# EAGLE board CrowPanel Pico Display-2.4_V1.0_240412 (EAGLE 9.6.2)
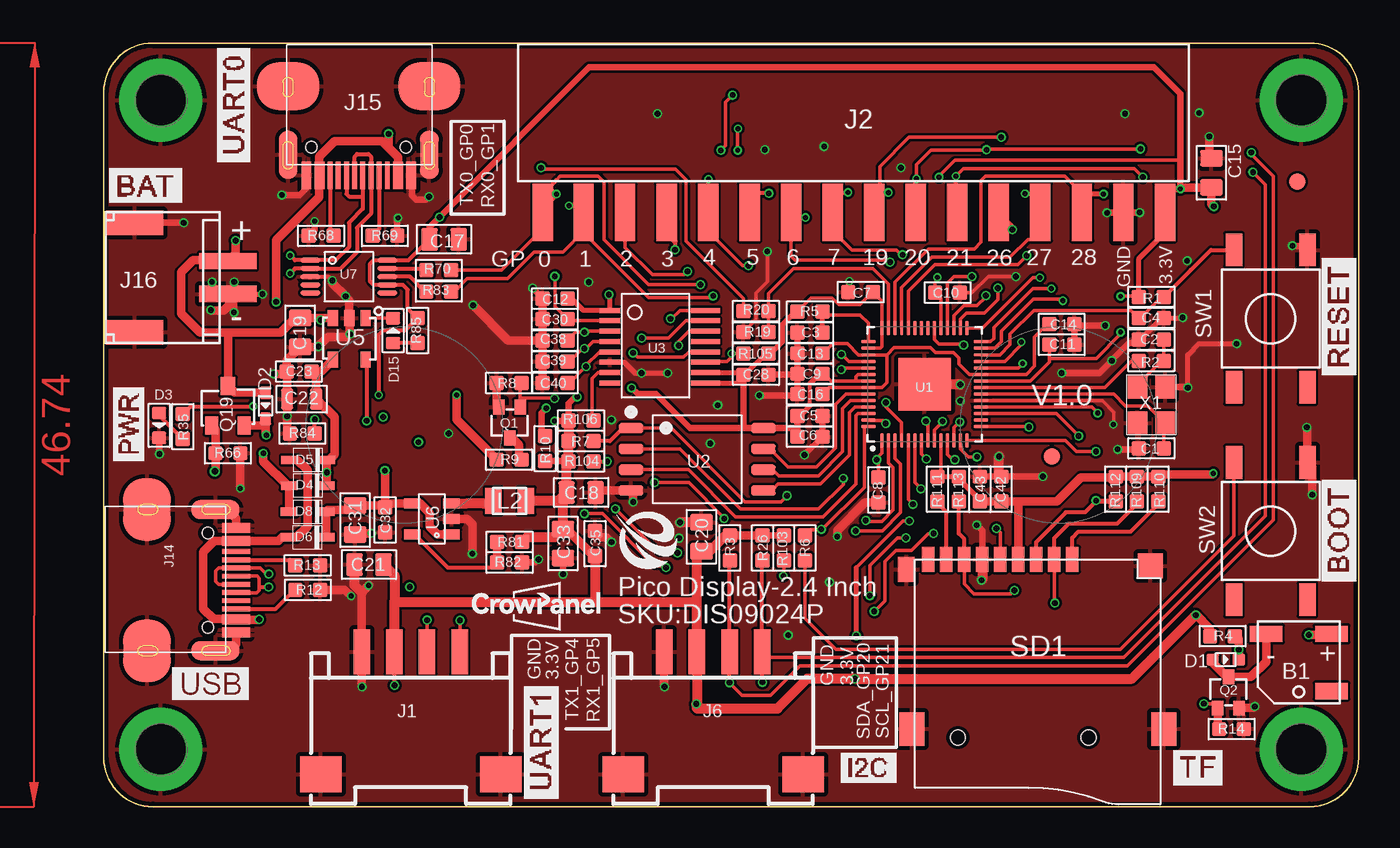
[diagram p5: board, top side]
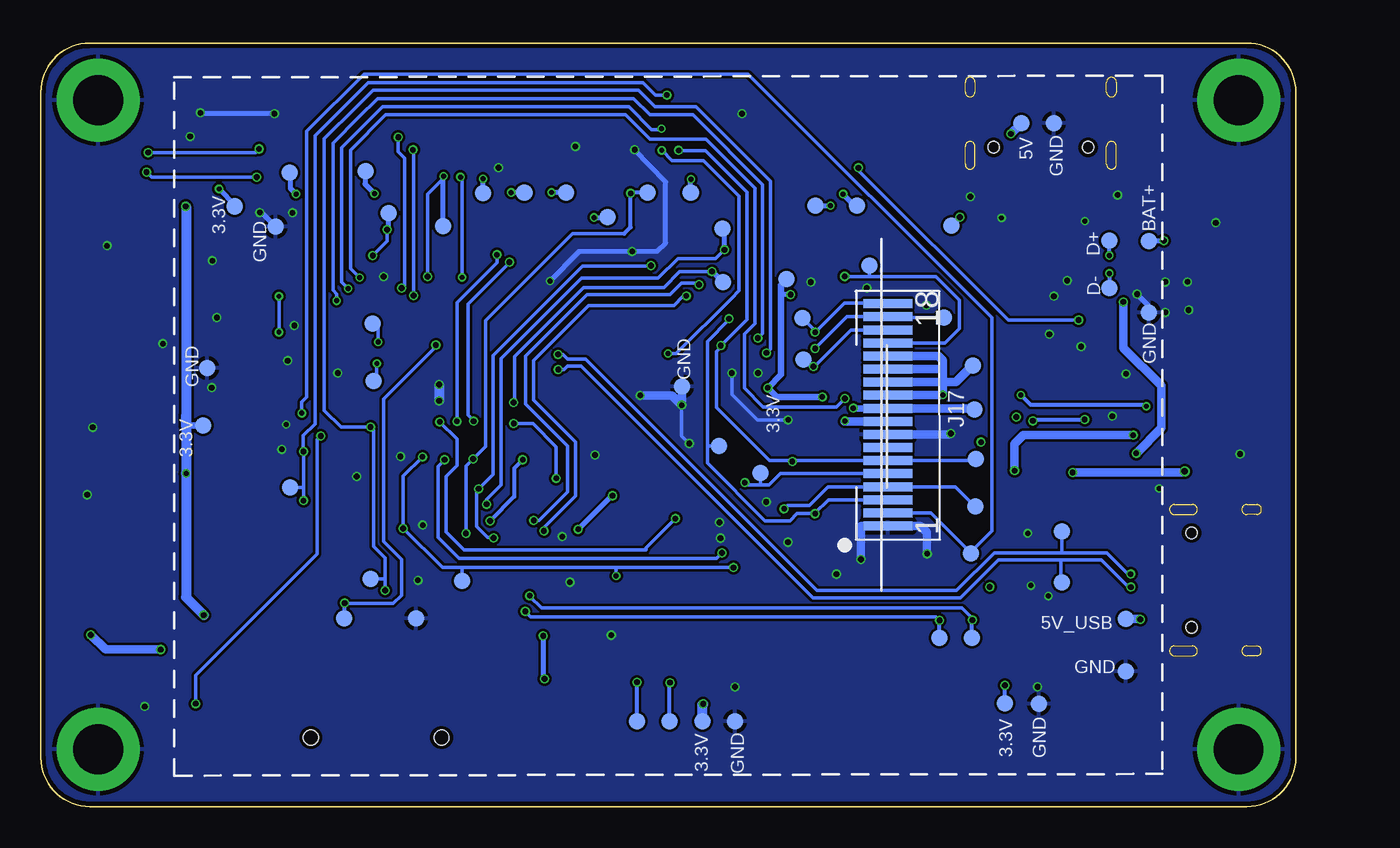
[diagram p6: board, bottom side, seen from below]

Size 76.76 x 46.72 mm. Coordinates in mm from the lower left corner, seen from the top.
Outline: 0,3 0,43.72 arc-90 3,46.72 73.76,46.72 arc-90 76.76,43.72 76.76,3 arc-90 73.76,0 3,0 arc-90 0,3
Copper layers (1*16): Top 0.035mm / dielectric 1.5mm / Bottom 0.035mm
Design rules "default *": minimum track width 0.2mm, minimum drill 0.3mm, track to track 6mil, track to pad 6mil, pad to pad 6mil, via to via 6mil, smd to smd 6mil, copper to edge 10mil, drill to drill 6mil, minimum pad ring 10mil, minimum via ring 4mil, stop-mask expansion 4mil, vias tented up to drill 100mil, thermal gap 10mil
Net classes: 1 PWR: width 0.254 mm; 2 GND: width 0.203 mm; 3 RS485: width 0.203 mm, clearance 0.203 mm; 4 USB: width 0.203 mm, clearance 0.152 mm; 5 ANT: width 0.889 mm, clearance 0.203 mm

## Footprints (pad centres in the part's own frame; a part is rotated, then mirrored left to right if it is on the bottom)
BEEP_5025 = smd 2 x 1: 1 -2,-1.75; 2 2,-1.75; 3 -2,1.75
A_XBJ_0603 = smd 0.889 x 0.889: 1 -0.762,0; 2 0.762,0
A_XBJ_0805 = smd 1.016 x 1.397: 1 -0.889,0; 2 0.889,0
0805_S = smd 0.762 x 1.27: 1 -0.889,0; 2 0.889,0
C0603 = smd 0.889 x 0.889: 1 -0.762,0; 2 0.762,0
DISCRETE_C0603 = smd 0.889 x 0.889: 1 -0.762,0; 2 0.762,0
0603 = smd 0.889 x 0.889: 1 -0.762,0; 2 0.762,0
SOD-523 = smd 0.762 x 0.7: + -0.8,0; - 0.8,0
DISCRETE_D0603 = smd 0.762 x 0.889: + -0.762,0; - 0.762,0
SOD-323 = smd 1.016 x 0.508: 1 1.137,0; 2 -1.137,0
CONNECTOR_4P-SMD-2.0-90D = smd 1.01 x 2.74: 1 -3,-0.1; 2 -1,-0.1; 3 1,-0.1; 4 3,-0.1 | smd 2.54 x 2.184: SS1 -5.5,7.4; SS2 5.5,7.4
2.54-16P-WOTIE = smd 1.25 x 3.5: 1 -18.999,-5.572; 2 -16.51,-5.572; 3 -13.97,-5.572; 4 -11.43,-5.572; 5 -8.89,-5.572; 6 -6.35,-5.572; 7 -3.81,-5.572; 8 -1.27,-5.572; 9 1.27,-5.572; 10 3.81,-5.572; 11 6.35,-5.572; 12 8.89,-5.572; 13 11.43,-5.572; 14 13.97,-5.572; 15 16.51,-5.572; 16 19.05,-5.572
KEVIN_3.0TYPEC-SMD = smd 0.3 x 1.7: A1 -3.35,0.5; A4 -2.55,0.5; A5 -1.25,0.5; A6 -0.25,0.5; A7 0.25,0.5; A8 1.25,0.5; A9 2.55,0.5; A12 3.35,0.5; B1 3.05,0.5; B4 2.25,0.5; B5 1.75,0.5; B6 0.75,0.5; B7 -0.75,0.5; B8 -1.75,0.5; B9 -2.25,0.5; B12 -3.05,0.5 | smd 1.143 x 2.921: P$6 -4.318,-0.762; P$7 4.318,-0.762 | smd 3.81 x 2.921: P$8 -4.318,-4.953; P$9 4.318,-4.953 | hole 0.68: -2.89,-1.22; 2.89,-1.22
PH2.0WT-2PIN = smd 1 x 3.5: P$1 -1,0; P$2 1,0 | smd 1.5 x 3.5: P$3 -3.35,-5.7; P$4 3.35,-5.7
QD241801-18PIN*0.8 = smd 0.55 x 3: P$1 -6.789,-1.538; P$2 -5.989,-1.538; P$3 -5.189,-1.538; P$4 -4.389,-1.538; P$5 -3.589,-1.538; P$6 -2.789,-1.538; P$7 -1.989,-1.538; P$8 -1.189,-1.538; P$9 -0.389,-1.538; P$10 0.411,-1.538; P$11 1.211,-1.538; P$12 2.011,-1.538; P$13 2.811,-1.538; P$14 3.611,-1.538; P$15 4.411,-1.538; P$16 5.211,-1.538; P$17 6.011,-1.538; P$18 6.811,-1.538
0806 = smd 1 x 1.6: 1 -1,0; 2 1,0
CROWPI_POW_PAD-1.0MM = smd 1 x 1: P$1 0,0
PAD-1.0MM = smd 1 x 1: P$1 0,0
SOT-323_W = smd 0.7 x 0.9: 1 -0.65,-0.95; 2 0.65,-0.95; 3 0,0.95
SOT-23 = smd 1.1 x 0.8: 1 1.2,-1; 2 1.2,1 | smd 1.1 x 0.9: 3 -1.2,0
DISCRETE_R0603 = smd 0.889 x 0.889: 1 -0.762,0; 2 0.762,0
9P-SMD-W/-RING = smd 1.524 x 0.762: 1 0,4.4; 2 0,3.3; 3 0,2.2; 4 0,1.1; 5 0,0; 6 0,-1.1; 7 0,-2.2; 8 0,-3.3; 9 0,-4.4 | smd 1.524 x 1.016: G1 0.6,-5.746 | smd 2.032 x 1.524: G2 10.373,-5.4; G3 10.373,10 | smd 1.524 x 1.524: G4 0.392,9.181 | hole 0.889: 10.9,-2.6; 10.9,5.4
KEY-6 = smd 2 x 1: 1 -4.2,2.25; 2 -4.2,-2.25; 3 4.2,-2.25; 4 4.2,2.25
3M-5 = drill 3.048 pad 5.08: 1 0,0
RP2040_QFN-56 = smd 0.875 x 0.2: 1 -3.437,2.6; 2 -3.437,2.2; 3 -3.437,1.8; 4 -3.437,1.4; 5 -3.437,1; 6 -3.437,0.6; 7 -3.437,0.2; 8 -3.437,-0.2; 9 -3.437,-0.6; 10 -3.437,-1; 11 -3.437,-1.4; 12 -3.437,-1.8; 13 -3.437,-2.2; 14 -3.437,-2.6; 29 3.437,-2.6; 30 3.437,-2.2; 31 3.437,-1.8; 32 3.437,-1.4; 33 3.437,-1; 34 3.437,-0.6; 35 3.437,-0.2; 36 3.437,0.2; 37 3.437,0.6; 38 3.437,1; 39 3.437,1.4; 40 3.437,1.8; 41 3.437,2.2; 42 3.437,2.6 | smd 0.2 x 0.875: 15 -2.6,-3.437; 16 -2.2,-3.437; 17 -1.8,-3.437; 18 -1.4,-3.437; 19 -1,-3.437; 20 -0.6,-3.437; 21 -0.2,-3.437; 22 0.2,-3.437; 23 0.6,-3.437; 24 1,-3.437; 25 1.4,-3.437; 26 1.8,-3.437; 27 2.2,-3.437; 28 2.6,-3.437; 43 2.6,3.437; 44 2.2,3.437; 45 1.8,3.437; 46 1.4,3.437; 47 1,3.437; 48 0.6,3.437; 49 0.2,3.437; 50 -0.2,3.437; 51 -0.6,3.437; 52 -1,3.437; 53 -1.4,3.437; 54 -1.8,3.437; 55 -2.2,3.437; 56 -2.6,3.437 | smd 3.2 x 3.2: EPAD 0,0
SELF_SOIC-8-208MIL = smd 1.5 x 0.635: 1 -4.05,1.905; 2 -4.05,0.635; 3 -4.05,-0.635; 4 -4.05,-1.905; 5 4.05,-1.905; 6 4.05,-0.635; 7 4.05,0.635; 8 4.05,1.905
XP2046-SSOP16 = smd 0.305 x 1.27: 1 -2.54,-2.54; 2 -1.905,-2.54; 3 -1.27,-2.54; 4 -0.635,-2.54; 5 0,-2.54; 6 0.635,-2.54; 7 1.27,-2.54; 8 1.905,-2.54 | smd 0.305 x 1.778: 9 1.905,3.302; 10 1.27,3.302; 11 0.635,3.302; 12 0,3.302; 13 -0.635,3.302; 14 -1.27,3.302; 15 -1.905,3.302; 16 -2.54,3.302
SOP23-5 = smd 1 x 0.635: 1 -1.27,1; 2 -1.27,0; 3 -1.27,-1; 4 1.27,-1; 5 1.27,1
CROWBOT_-V1.0-20220525_A_XBJ_SOT23-5 = smd 0.6 x 1: 1 -0.95,-1.2; 2 0,-1.2; 3 0.95,-1.2; 4 0.95,1.2; 5 -0.95,1.2
MSOP-10_W = smd 1.2 x 0.3: 1 -2.35,1; 2 -2.35,0.5; 3 -2.35,0; 4 -2.35,-0.5; 5 -2.35,-1; 6 2.35,-1; 7 2.35,-0.5; 8 2.35,0; 9 2.35,0.5; 10 2.35,1
A_XBJ_SMD3225 = smd 1.4 x 1.2: 1 -1.1,-0.85; 2 1.1,-0.85; 3 1.1,0.85; 4 -1.1,0.85

## Placement (x,y rotation side)
B1  BEEP_5025  [BEEP_5025]  73.1,8.82 180 top
C1  12PF  [A_XBJ_0603]  64.08,21.92 180 top
C2  12PF  [A_XBJ_0603]  64.08,28.59 0 top
C3  2.2UF  [A_XBJ_0603]  43.2,29 180 top
C4  100NF  [A_XBJ_0603]  64.08,29.9 0 top
C5  100NF  [A_XBJ_0603]  43.2,23.9 0 top
C6  2.2UF  [A_XBJ_0603]  43.2,22.63 0 top
C7  100NF  [A_XBJ_0603]  46.3,31.48 180 top
C8  100NF  [A_XBJ_0603]  47.4,19.37 270 top
C9  100NF  [A_XBJ_0603]  43.2,26.48 180 top
C10  100NF  [A_XBJ_0603]  51.62,31.44 0 top
C11  100NF  [A_XBJ_0603]  58.6,28.26 0 top
C12  100NF  [A_XBJ_0603]  27.6,31.08 180 top
C13  100NF  [A_XBJ_0603]  43.2,27.73 180 top
C14  100NF  [A_XBJ_0603]  58.6,29.52 0 top
C15  47UF  [A_XBJ_0805]  67.76,38.78 270 top
C16  2.2UF  [A_XBJ_0603]  43.2,25.23 180 top
C17  47UF  [A_XBJ_0805]  20.82,34.71 0 top
C18  22UF  [A_XBJ_0805]  29.2,19.22 180 top
C19  22UF  [A_XBJ_0805]  12.02,29.01 90 top
C20  47UF  [A_XBJ_0805]  36.56,16.51 90 top
C21  47UF  [A_XBJ_0805]  16.23,14.81 180 top
C22  22uF  [0805_S]  12.12,24.94 0 top
C23  100nF  [C0603]  11.95,26.62 180 top
C28  1uF  [DISCRETE_C0603]  39.9,26.42 180 top
C30  100pF  [0603]  27.6,29.82 0 top
C31  22UF  [A_XBJ_0805]  15.38,17.53 90 top
C32  1UF  [A_XBJ_0603]  17.21,17.54 270 top
C33  22UF  [A_XBJ_0805]  28.09,16.09 90 top
C35  100NF  [A_XBJ_0603]  30.06,16.09 90 top
C38  100pF  [0603]  27.6,28.52 0 top
C39  100pF  [0603]  27.6,27.22 0 top
C40  100pF  [0603]  27.6,25.92 0 top
C42  1uF  [DISCRETE_C0603]  54.9,19.42 270 top
C43  100nF  [C0603]  53.6,19.42 90 top
D1  B5819WT  [SOD-523]  68.63,9 0 top
D2  B5819WT  [SOD-523]  9.9,24.52 270 top
D3  [DISCRETE_D0603]  3.39,23.32 270 top
D4  SOD-323  [SOD-323]  12.49,19.64 180 top
D5  SOD-323  [SOD-323]  12.5,21.21 180 top
D6  SOD-323  [SOD-323]  12.47,16.48 180 top
D8  SOD-323  [SOD-323]  12.47,18.04 180 top
D15  [DISCRETE_D0603]  17.7,29.12 90 top
J1  [CONNECTOR_4P-SMD-2.0-90D]  18.78,9.37 180 top
J2  2.54-16PIN-WOTIE  [2.54-16P-WOTIE]  45.86,41.92 0 top
J6  [CONNECTOR_4P-SMD-2.0-90D]  37.28,9.37 180 top
J14  USB_TYPE-C_16PIN3.0USB  [KEVIN_3.0TYPEC-SMD]  7.6,13.85 270 top
J15  USB_TYPE-C_16PIN3.0USB  [KEVIN_3.0TYPEC-SMD]  15.6,39.12 180 top
J16  PH2.0WT-2PIN  [PH2.0WT-2PIN]  7.6,32.37 270 top
J17  QD281801  [QD241801-18PIN*0.8]  26.5,23.96 90 bottom
L2  2.2UH1.7A  [0806]  24.83,18.7 0 top
P1  CROWPI_POW_PADPAD-1.0MM  [CROWPI_POW_PAD-1.0MM]  10.41,8.27 0 bottom
P2  CROWPI_POW_PADPAD-1.0MM  [CROWPI_POW_PAD-1.0MM]  10.41,11.47 0 bottom
P3  CROWPI_POW_PADPAD-1.0MM  [CROWPI_POW_PAD-1.0MM]  14.3,13.71 0 bottom
P4  CROWPI_POW_PADPAD-1.0MM  [CROWPI_POW_PAD-1.0MM]  14.3,16.82 0 bottom
P5  CROWPI_POW_PADPAD-1.0MM  [CROWPI_POW_PAD-1.0MM]  19.66,24.29 0 bottom
P6  CROWPI_POW_PADPAD-1.0MM  [CROWPI_POW_PAD-1.0MM]  8.98,30.23 0 bottom
P7  CROWPI_POW_PADPAD-1.0MM  [CROWPI_POW_PAD-1.0MM]  9,34.61 0 bottom
P8  CROWPI_POW_PADPAD-1.0MM  [CROWPI_POW_PAD-1.0MM]  26.85,36.78 0 bottom
P9  CROWPI_POW_PADPAD-1.0MM  [CROWPI_POW_PAD-1.0MM]  53.8,11.52 0 bottom
P10  CROWPI_POW_PADPAD-1.0MM  [CROWPI_POW_PAD-1.0MM]  17.8,6.32 0 bottom
P11  CROWPI_POW_PADPAD-1.0MM  [CROWPI_POW_PAD-1.0MM]  56.4,26.05 0 bottom
P12  CROWPI_POW_PADPAD-1.0MM  [CROWPI_POW_PAD-1.0MM]  56.46,29.56 0 bottom
P13  CROWPI_POW_PADPAD-1.0MM  [CROWPI_POW_PAD-1.0MM]  66.83,23.3 0 bottom
P14  CROWPI_POW_PADPAD-1.0MM  [CROWPI_POW_PAD-1.0MM]  15.71,6.3 0 bottom
P15  CROWPI_POW_PADPAD-1.0MM  [CROWPI_POW_PAD-1.0MM]  38.3,5.22 0 bottom
P16  CROWPI_POW_PADPAD-1.0MM  [CROWPI_POW_PAD-1.0MM]  40.3,5.22 0 bottom
P17  CROWPI_POW_PADPAD-1.0MM  [CROWPI_POW_PAD-1.0MM]  29.39,36.78 0 bottom
P18  CROWPI_POW_PADPAD-1.0MM  [CROWPI_POW_PAD-1.0MM]  35.03,32.08 0 bottom
P19  CROWPI_POW_PADPAD-1.0MM  [CROWPI_POW_PAD-1.0MM]  35.07,35.37 0 bottom
P20  CROWPI_POW_PADPAD-1.0MM  [CROWPI_POW_PAD-1.0MM]  37.01,37.57 0 bottom
P21  CROWPI_POW_PADPAD-1.0MM  [CROWPI_POW_PAD-1.0MM]  34.3,5.22 0 bottom
P22  CROWPI_POW_PADPAD-1.0MM  [CROWPI_POW_PAD-1.0MM]  36.3,5.22 0 bottom
P23  CROWPI_POW_PADPAD-1.0MM  [CROWPI_POW_PAD-1.0MM]  19.8,10.32 0 bottom
P24  CROWPI_POW_PADPAD-1.0MM  [CROWPI_POW_PAD-1.0MM]  21.8,10.32 0 bottom
P25  CROWPI_POW_PADPAD-1.0MM  [CROWPI_POW_PAD-1.0MM]  14.8,41.82 0 bottom
P26  CROWPI_POW_PADPAD-1.0MM  [CROWPI_POW_PAD-1.0MM]  16.8,41.82 0 bottom
P27  CROWPI_POW_PADPAD-1.0MM  [CROWPI_POW_PAD-1.0MM]  11.4,34.62 0 bottom
P28  CROWPI_POW_PADPAD-1.0MM  [CROWPI_POW_PAD-1.0MM]  11.4,31.72 0 bottom
P29  CROWPI_POW_PADPAD-1.0MM  [CROWPI_POW_PAD-1.0MM]  37.54,25.7 0 bottom
P30  CROWPI_POW_PADPAD-1.0MM  [CROWPI_POW_PAD-1.0MM]  64.9,36.72 0 bottom
P31  CROWPI_POW_PADPAD-1.0MM  [CROWPI_POW_PAD-1.0MM]  19.88,15.49 0 bottom
P32  CROWPI_POW_PADPAD-1.0MM  [CROWPI_POW_PAD-1.0MM]  35.29,22.07 0 bottom
P33  CROWPI_POW_PADPAD-1.0MM  [CROWPI_POW_PAD-1.0MM]  26.09,33.1 0 bottom
P34  CROWPI_POW_PADPAD-1.0MM  [CROWPI_POW_PAD-1.0MM]  19.59,18.37 0 bottom
P35  CROWPI_POW_PADPAD-1.0MM  [CROWPI_POW_PAD-1.0MM]  32.74,20.42 0 bottom
P36  CROWPI_POW_PADPAD-1.0MM  [CROWPI_POW_PAD-1.0MM]  61.5,19.52 0 bottom
P37  CROWPI_POW_PADPAD-1.0MM  [CROWPI_POW_PAD-1.0MM]  30.12,27.36 0 bottom
P38  CROWPI_POW_PADPAD-1.0MM  [CROWPI_POW_PAD-1.0MM]  21.52,29.94 0 bottom
P39  CROWPI_POW_PADPAD-1.0MM  [CROWPI_POW_PAD-1.0MM]  30.17,29.88 0 bottom
P40  CROWPI_POW_PADPAD-1.0MM  [CROWPI_POW_PAD-1.0MM]  31.15,32.26 0 bottom
P41  CROWPI_POW_PADPAD-1.0MM  [CROWPI_POW_PAD-1.0MM]  19.75,26.99 0 bottom
P42  CROWPI_POW_PADPAD-1.0MM  [CROWPI_POW_PAD-1.0MM]  66.6,26.82 0 bottom
P43  CROWPI_POW_PADPAD-1.0MM  [CROWPI_POW_PAD-1.0MM]  21.07,35.53 0 bottom
P44  CROWPI_POW_PADPAD-1.0MM  [CROWPI_POW_PAD-1.0MM]  19.56,21.28 0 bottom
P45  CROWPI_POW_PADPAD-1.0MM  [CROWPI_POW_PAD-1.0MM]  51,13.82 0 bottom
P46  CROWPI_POW_PADPAD-1.0MM  [CROWPI_POW_PAD-1.0MM]  56.6,13.92 0 bottom
P47  CROWPI_POW_PADPAD-1.0MM  [CROWPI_POW_PAD-1.0MM]  58.2,11.52 0 bottom
P48  PADPAD-1.0MM  [PAD-1.0MM]  73,38.22 0 top
P49  PADPAD-1.0MM  [PAD-1.0MM]  58,21.42 0 top
P50  CROWPI_POW_PADPAD-1.0MM  [CROWPI_POW_PAD-1.0MM]  39.65,37.57 0 bottom
P51  CROWPI_POW_PADPAD-1.0MM  [CROWPI_POW_PAD-1.0MM]  42.11,36.06 0 bottom
P52  CROWPI_POW_PADPAD-1.0MM  [CROWPI_POW_PAD-1.0MM]  44.65,37.56 0 bottom
P53  CROWPI_POW_PADPAD-1.0MM  [CROWPI_POW_PAD-1.0MM]  47.19,37.56 0 bottom
P54  CROWPI_POW_PADPAD-1.0MM  [CROWPI_POW_PAD-1.0MM]  49.71,37.52 0 bottom
P55  CROWPI_POW_PADPAD-1.0MM  [CROWPI_POW_PAD-1.0MM]  52.15,35.52 0 bottom
P56  CROWPI_POW_PADPAD-1.0MM  [CROWPI_POW_PAD-1.0MM]  55.49,36.32 0 bottom
P57  CROWPI_POW_PADPAD-1.0MM  [CROWPI_POW_PAD-1.0MM]  56.91,38.88 0 bottom
P58  CROWPI_POW_PADPAD-1.0MM  [CROWPI_POW_PAD-1.0MM]  61.55,38.78 0 bottom
P59  CROWPI_POW_PADPAD-1.0MM  [CROWPI_POW_PAD-1.0MM]  62.39,35.48 0 bottom
Q1  HXY2102EI  [SOT-323_W]  24.83,23.5 180 top
Q2  HXY2102EI  [SOT-323_W]  68.79,6.99 0 top
Q19  PMOS-3401-4A  [SOT-23]  7.6,24.52 270 top
R1  10K  [DISCRETE_R0603]  64.08,31.18 180 top
R2  1K  [DISCRETE_R0603]  64.08,27.26 180 top
R3  4.7K  [DISCRETE_R0603]  38.3,15.82 90 top
R4  3R  [DISCRETE_R0603]  68.43,10.43 180 top
R5  0R  [DISCRETE_R0603]  43.2,30.28 180 top
R6  1K  [DISCRETE_R0603]  42.9,15.82 270 top
R7  10K  [DISCRETE_R0603]  29.2,22.37 180 top
R8  10K/NC  [DISCRETE_R0603]  24.8,25.92 0 top
R9  0R 1%  [DISCRETE_R0603]  24.8,21.22 180 top
R10  3R  [DISCRETE_R0603]  27,21.91 270 top
R12  5.1K  [DISCRETE_R0603]  12.49,13.26 0 top
R13  5.1K  [DISCRETE_R0603]  12.47,14.76 180 top
R14  10K/NC  [DISCRETE_R0603]  68.99,4.75 180 top
R19  100K1%  [DISCRETE_R0603]  39.9,29.02 180 top
R20  100K1%  [DISCRETE_R0603]  39.9,30.32 0 top
R26  4.7K  [DISCRETE_R0603]  40.3,15.82 90 top
R35  4.7K  [DISCRETE_R0603]  4.84,23.25 90 top
R66  10K  [DISCRETE_R0603]  7.6,21.62 180 top
R68  5.1K  [DISCRETE_R0603]  13.3,34.92 180 top
R69  5.1K  [DISCRETE_R0603]  17.2,34.92 180 top
R70  0R  [DISCRETE_R0603]  20.5,32.82 0 top
R81  45.3K 1%  [DISCRETE_R0603]  24.83,16.19 180 top
R82  10K 1%  [DISCRETE_R0603]  24.83,14.93 180 top
R83  0R  [DISCRETE_R0603]  20.5,31.52 0 top
R84  2K  [DISCRETE_R0603]  12.15,22.84 180 top
R85  4.7K  [DISCRETE_R0603]  19.2,29.12 90 top
R103  1K  [DISCRETE_R0603]  41.6,15.82 90 top
R104  1K  [DISCRETE_R0603]  29.2,21.12 180 top
R105  10K  [DISCRETE_R0603]  39.9,27.72 0 top
R106  10K/NC  [DISCRETE_R0603]  29.2,23.62 0 top
R109  10K  [DISCRETE_R0603]  63.2,19.42 270 top
R110  10K  [DISCRETE_R0603]  64.5,19.42 270 top
R111  10K  [DISCRETE_R0603]  51,19.42 270 top
R112  10K  [DISCRETE_R0603]  61.9,19.42 270 top
R113  10K  [DISCRETE_R0603]  52.3,19.42 270 top
SD1  [9P-SMD-W/-RING]  54.84,15.12 270 top
SW1  KEY-6  [KEY-6]  71.38,29.86 270 top
SW2  KEY-6  [KEY-6]  71.38,16.86 270 top
T1  3M-5  [3M-5]  3.5,43.22 0 top
T2  3M-5  [3M-5]  3.5,3.5 0 top
T3  3M-5  [3M-5]  73.26,3.5 0 top
T4  3M-5  [3M-5]  73.26,43.22 0 top
U1  RP2040_RP2040  [RP2040_QFN-56]  50.21,25.84 90 top
U2  SELF_W25Q128JV  [SELF_SOIC-8-208MIL]  36.3,21.25 0 top
U3  XPT2046  [XP2046-SSOP16]  33.5,27.82 270 top
U5  4054A  [SOP23-5]  15.02,28.62 270 top
U6  HM3416H  [CROWBOT_-V1.0-20220525_A_XBJ_SOT23-5]  20.07,17.6 90 top
U7  CH340X  [MSOP-10_W]  15,32.42 0 top
X1  12MHZ_SMD3225  [A_XBJ_SMD3225]  64.08,24.57 90 top

## Tracks (layer width: path | path; a pad name or v marks a point on that pad's centre or on a via)
+1V1
  Top 0.2: C14.1 57.73,29.52 56.94,28.74 56.94,26.95 56.44,26.44 U1.23 52.94,26.44 52.32,27.06 52.32,27.44 51.98,27.78 51.29,27.78 51.28,27.79 50.86,27.79 50.57,28.08 48.34,28.08 47.9,27.64 | U1.50 47.61,25.64 47.9,25.93 47.9,27.64 | U1.45 47.9,27.64
  Top 0.203: C13.1 44.01,27.73 44.6,28.32 45.48,28.32 46.16,27.64 U1.45 | C16.1 44.37,25.64 U1.50
+3V3  (via drill 0.3, 0.35)
  Top 0.2: U1.1 47.61,21.63 47.4,21.42 47.4,21.21 | C7.1 47.61,30.94 U1.42 47.61,28.14 47.51,28.04 U1.44 | U1.22 56.68,26.04 57.84,27.2 57.84,27.42 C11.1 | C8.1 47.4,21.21 | v47.29,21.22 47.39,21.22 47.4,21.21 | v49.29,17.48 48.89,17.48 46.02,14.61 | 46.02,10.46 v46.03,10.44 | U1.33 51.21,31.09 C10.1 50.86,32.08 | U1.48 46.14,26.44 46,26.3 46,26.04 | J2.16 64.91,35.12 64.43,34.64
  Top 0.203: 44.3,26.48 C9.1 44.04,26.48 44.48,26.04 46,26.04 U1.49 | R111.1 51.3,20.19 51.21,20.28 U1.10 | 57.84,27.42 60.72,27.42 62.2,28.9 v62.2,29.02 | v62.2,31.22 63.32,31.22 | C7.1 46.27,30.71 44.97,30.71 44.55,31.12 43.27,31.12 R5.2 | 50.86,32.08 51.05,32.33 v50.99,32.39 | v51.1,38.52 51.1,38.58 52.07,39.56 65.86,39.56
  Top 0.254: 43.21,24.54 43.21,25.9 | v17.8,7.42 17.8,9.45 J1.3 | C6.1 42.44,23.06 | R35.2 5.32,24.49 v9.15,24.49 | v16.82,25.19 v16.81,25.19 16.81,28.86 17.08,29.13 18.45,29.13 R85.2 18.6,30.49 18.6,31.62 18.3,31.92 U7.7 16.5,31.92 16.3,32.12 16.3,33.22 16.5,33.42 U7.10 18.65,33.43 C17.1
  Top 0.3: 46.02,14.61 46.02,10.46
  Top 0.305: 51.3,20.19 R113.1 | U3.9 39.09,25.92 39.14,25.96 C28.2 | U3.10 39.01,26.55 C28.2 | C28.2 39.24,26.42 40.54,27.72 R105.2 40.79,27.72 41.55,28.48 41.55,29.53 42.3,30.28 R5.2 | 43.21,24.54 42.58,23.9 C5.1 | C9.1 43.9,26.54 43.86,26.54 43.21,25.9 | 39.14,23.16 U2.8 | C12.1 28.62,31.08 29.34,30.36 U3.1 30.96,31.26 v30.9,31.32 | R1.2 63.32,31.22 63.32,33.53 64.43,34.64 65.08,35.29 | C43.1 53.6,18.76 52.3,20.06
  Top 0.406: C6.1 42.47,22.68 42.44,22.77 C5.1 | 42.44,23.06 42.34,23.16 U2.8 35.87,23.16 33.78,25.24 32.68,25.24 v32.3,25.62 | C28.2 39.14,23.16 | R103.2 R26.2 | 65.86,39.56 65.86,43.61 64.25,45.22 29.7,45.22 v20.55,36.07 19.93,35.46 C17.1 | 65.86,39.56 v65.86,37.79 | 65.85,37.86 65.85,37.81 v65.86,37.79 | J2.16 64.91,37.65 65.06,37.79 v65.86,37.79 | 28.43,23.61 28.42,23.6 v27.58,23.6 | R10.2 28.17,21.14 28.31,21 | R106.1 28.44,24.66 28.85,25.07 v28.97,25.07
  Top 0.508: 27.59,16.48 C33.2 28.22,16.86 | R3.2 R26.2 | C43.1 C42.2 55.9,18.66 | 52.3,20.06 R113.1 | 55.9,18.66 58.3,18.66 59.76,20.12 61.84,20.12 R112.1 R109.1 R110.1 64.65,20.34 67.82,20.34 v67.88,20.39 | R106.1 28.43,23.61 28.43,23.42 | 55.9,18.66 55.94,18.62 SD1.4 | C35.1 29.96,15.33 28.44,16.86 | v66.8,11.72 66.82,11.72 67.67,10.87 R4.2 | v67.9,36.72 67.76,36.87 C15.2 65.96,37.89 v65.86,37.79
  Top 0.61: J1.3 17.78,12.16 17.78,12.53 | R106.1 R7.2 R104.2 28.31,21 C18.2 | R81.1 25.88,16.48 27.59,16.48 | 36.28,12.37 J6.3 36.28,6.31 | 17.78,12.53 30,12.53 | 30,12.53 36.12,12.53 36.28,12.37 | C33.2 28.09,19 C18.2 | 28.44,16.86 28.22,16.86 | C35.1 30.06,12.59 30,12.53 | 36.28,6.31 36.28,6.03 36.3,6.01 41.22,6.01 43.03,7.82 v45.95,7.82 62.9,7.82 v66.8,11.72 | v36.25,6.28 36.28,6.31 | C18.2 27.79,18.7 L2.2 | 36.28,12.37 36.28,15.34 C20.1 37.06,15.62 38.02,16.59 R3.2 | C21.1 17.78,14.15 17.78,12.53
  Bottom 0.2: 46.03,7.9 v45.95,7.82
  Bottom 0.203: v62.2,29.02 v62.2,31.22 | v50.99,32.39 50.99,38.41 v51.1,38.52 | 66.85,23.32 P13.P$1
  Bottom 0.254: v47.29,21.22 47.81,20.7 47.81,18.96 v49.29,17.48 | P10.P$1 v17.8,7.42 | v9.15,24.49 9.25,24.59 16.22,24.59 v16.82,25.19
  Bottom 0.305: v46.03,10.44 46.03,7.9 | v30.9,31.32 31.5,31.32 | P30.P$1 64.9,36.81 65.86,37.77 v65.86,37.79
  Bottom 0.406: P43.P$1 20.55,36.05 v20.55,36.07 | P13.P$1 67.88,23.3 | 67.88,23.9 67.9,23.92 | v28.97,25.07 31.75,25.07 v32.3,25.62 31.5,26.42 31.5,31.32 31.5,31.91 P40.P$1
  Bottom 0.508: J17.P$9 27.55,23.57 v27.58,23.6 27.62,23.56
  Bottom 0.61: v67.9,36.72 67.88,36.72 67.88,23.9 67.88,23.3 v67.88,20.39 67.88,12.8 v66.8,11.72 | 67.9,23.92 67.9,23.32 | P22.P$1 36.3,6.23 v36.25,6.28
+5V_UART0  (via drill 0.35)
  Top 0.254: J15.A9 J15.B4 | J15.A4 18.02,38.62 17.91,38.74 18.03,38.74 J15.A4 | J15.A4 18.01,38.77 | J15.B9 J15.A4
  Top 0.305: 13.19,37.82 13.19,38.48 J15.A9 13.18,38.75
  Top 0.508: D8.1 11.34,19.63 | 11.34,19.63 D4.1 | 13.19,38.62 13.19,37.82 13.19,37.3 10.55,34.66 v10.55,30.89 v10.55,30.88 | 18.01,38.77 18.01,39.73 17.42,40.32 | 17.42,40.32 17.03,40.71 14.13,40.71 13.18,39.76 13.18,38.75 | 17.42,40.32 17.43,40.34 v17.43,41.16 | v9.76,21.62 9.76,21.13 11.27,19.63 11.34,19.63
  Bottom 0.508: v17.43,41.16 16.8,41.79 P26.P$1 | v10.55,30.88 10.55,28.07 8.23,25.75 8.23,23.15 v9.76,21.62
+5V_USB  (via drill 0.35)
  Top 0.254: J14.B4 7.97,11.47 7.84,11.47 | 7.94,16.24 7.7,16.24 | J14.A4 8.1,16.39 7.96,16.24 | 8.1,11.47 J14.A9 8.24,11.44 | J14.A4 J14.B9 | J14.A4 8.24,16.27 8.26,16.27
  Top 0.508: 8.1,11.47 7.84,11.47 6.74,11.47 6.1,12.11 6.1,15.58 6.77,16.24 7.7,16.24 7.96,16.24 | 8.26,16.27 10.69,16.27 10.9,16.48 D6.1 11.79,16.48 12.47,17.16 12.47,20.59 11.85,21.21 D5.1 | v9.51,11.46 9.49,11.44 8.24,11.44
  Bottom 0.508: v9.51,11.46 9.52,11.47 P2.P$1
AVDD
  Top 0.203: U1.43 46.77,29.57 46.26,30.08 44.16,30.08 R5.1
  Top 0.305: C3.1 R5.1
BAT+  (via drill 0.35)
  Top 0.203: R20.1 39.14,31.09 35.61,34.61 35.61,38.35 34.97,38.99 26.85,38.99 v26.76,39.08 | 13.28,29.76 v13.29,29.77 13.9,29.77 U5.3
  Top 0.508: D2.+ 8,25.32 Q19.3 7.6,28.98 7.64,29.02 | U5.3 C19.2 11.72,29.9 10.83,29.02 7.64,29.02 | 7.64,29.02 5.91,29.02 4.75,30.18 4.75,32.7 5.47,33.42 7.55,33.42 J16.P$1 8.06,33.84 8.06,34.62 v8.08,34.63
  Bottom 0.203: v13.29,29.77 13.3,29.76 17.59,29.76 26.76,38.92 v26.76,39.08
  Bottom 0.305: P7.P$1 8.98,34.63 v8.08,34.63
BOOT
  Top 0.2: 65.9,13.32 62.2,9.62 44.8,9.62 42.9,11.52 R6.2 | SW2.2 69.13,16.55 68.86,16.29
  Top 0.203: 68.86,16.29 65.9,13.32
  Top 0.305: 69.13,20.81 SW2.2
CHG_LED
  Top 0.2: D15.- 16.03,29.89 U5.1
GND  (via drill 0.3, 0.35)
  Top 0.203: C7.2 45.54,32.08 v45.62,32.16 | U1.19 61.08,24.84 61.8,24.12 61.8,23.42 v61.75,23.37 | C10.2 53.12,31.44 54.11,32.43 v55.79,32.43 | R19.2 39.9,29.79 39.9,31.42 40.59,32.11 v40.59,33.97
  Top 0.254: U7.3 13.75,32.42 v13.99,32.19
  Top 0.305: U3.6 31.84,27.19 32.5,26.52 v32.9,26.52 v34.5,26.52 | J15.A12 12.35,38.62 | J15.A1 18.85,38.52 | v66,29.92 65.98,29.9 C4.2 64.74,29.9 63.42,28.59 C2.1 | v66.31,25.63 66.31,27.63 67,28.32 v69.3,28.32 | J16.P$2 9.7,31.37 v9.72,31.36
  Top 0.406: J16.P$3 v4.9,35.72 | J16.P$2 7.6,30.64 | 7.97,31.01 v7.97,30.24 | v11.22,23.89 v11.23,23.89 11.23,23.99 | C12.2 26.84,31.13 v26.24,31.72 | v12.9,35.82 12.9,35.28 R68.2 | R69.1 17.96,35.99 v18,36.02 | C5.2 C6.2 42.87,21.54 v42.87,21.51 | C9.2 C16.2 42.37,25.16 v40.1,25.16 | C9.2 C13.2 C3.2 | C28.1 42.38,26.42 C9.2 | C43.2 C42.1 v57.44,20.19 v57.45,20.19 | C2.1 63.11,28.37 62.72,28.37 61.67,27.32 v61.67,27.28 60.91,26.52 v58.6,26.52 | X1.2 66.27,25.67 v66.31,25.63 | C1.2 63.26,21.86 v62.02,21.86 | SD1.6 53.74,16.88 v53.4,17.22 | C11.2 C14.2 59.45,29.43 v61.26,29.43 | C33.1 v28.09,14.23 v28.1,14.22 | v26.6,15.12 26.41,14.93 R82.1 | 12.35,38.62 12.35,37.77 12,37.42 v10.9,37.42 | 18.85,38.52 18.85,37.37 19.1,37.12 19.7,37.12 v19.9,37.32 | SW1.1 73.38,34.31 v72.71,34.31 | v63.37,36.35 J2.15 61.39,36.35 v61.37,36.33 | D3.- 3.39,21.59 v3.41,21.57
  Top 0.508: v22.55,15.47 22.57,15.5 22.57,17.25 22.22,17.6 U6.2 | v15.8,7.32 15.78,7.34 J1.4 15.78,13.1 v16.2,13.52 16.24,13.56 | J6.4 34.28,7.34 v34.3,7.32 | 11.39,22.75 R84.2 11.23,23 11.23,23.99 C22.1 11.23,26.57 C23.2 | v15.13,12.88 14.75,13.26 R12.2 | C31.1 15.46,16.72 v16.4,16.72 | C35.2 30.43,16.48 30.76,16.48 v31.06,16.18 | C18.1 30.21,19.35 U2.4 32.39,19.21 v32.39,18.64 | C8.2 46.58,18.61 44.87,16.9 v44.87,16.52 | Q1.2 24.04,24.6 R8.1 | C40.1 C39.1 C38.1 | C38.1 C30.1 C12.2 | C38.1 24.74,28.52 v22.59,30.67 | v70.41,6.13 70.31,6.04 Q2.2 | J14.A1 8.1,17.62 7.5,18.22 6.89,18.22 J14.P$6 | J14.A12 8.1,9.92 7.6,9.42 6.95,9.42 J14.P$7 | v73.92,19.08 73.92,20.77 SW2.1 73.63,23.17 v73.59,23.21 | R66.1 v8.36,19.47 | 7.97,31.01 7.6,30.64 7.33,30.36 6.57,30.36 v6.56,30.38 | v6.63,32.11 6.63,31.37 J16.P$2 7.98,31.76 v7.98,32.11 | C23.2 11.04,26.48 v10.39,26.48 | C23.2 11.19,27.29 C19.1 13.1,28.12 v13.13,28.15 13.71,28.73 14.91,28.73 v15.08,28.9 15.04,28.95 15.04,29.88 U5.2 15.03,31 v14.8,31.22 13.99,32.04 v13.99,32.19 | C15.1 67.63,39.79 v67.63,41
  Top 0.61: SD1.6 53.74,13.9 v53.7,13.86 | U1.EPAD 52.38,25.84 v52.4,25.82 | C42.1 54.77,20.32 v54.77,21.42 | C20.2 35.27,17.4 v35.25,17.38 | 15.78,13.1 15.34,13.54 C21.2
  Bottom 0.203: v37.56,24.56 37.56,22.68 v37.1,22.22 | v34.5,26.52 34.5,25.22 32.94,23.67 v31.05,23.67
  Bottom 0.305: v45.62,32.16 43.86,33.91 43.86,33.97 39.06,33.97 38.55,34.48 38.55,38.24 v40.44,40.19 | v62.47,42.39 66.95,42.39 v67,42.45 | P6.P$1 8.98,30.62 v9.72,31.36 | P59.P$1 63.26,36.35 v63.37,36.35
  Bottom 0.508: v40.1,25.16 38.16,25.16 v37.56,24.56 37.54,24.59 P29.P$1 | J17.P$8 21.16,22.77 v21.1,22.83 | J17.P$8 23.71,22.77 | J17.P$8 22.13,22.77 | v22.55,15.47 22.55,16.77 22.95,17.17 J17.P$1 26.57,17.17 26.59,17.15 v26.59,15.13 v26.6,15.12
  Bottom 0.61: v52.4,25.82 v52.4,24.82
  other vias: 29.67,32.09 66.27,33.39 44.07,40.39 33.87,42.39 48.77,39.09 41.87,10.49 44.4,13.73 35.18,16.42
  pour Top: -0.5,47.22 -0.5,-0.78 77.5,-0.78 77.5,47.22
  pour Bottom: -1,47.22 -1,-1.28 78,-1.28 78,47.72 -1,47.72
GND1  (via drill 0.35)
  other vias: 17.09,23.83
GND2  (via drill 0.35)
  other vias: 19.25,22.3
GND3  (via drill 0.35)
  other vias: 18.72,13.44
GP0/UART0_TX  (via drill 0.3, 0.35)
  Top 0.2: R70.2 24.34,32.82 27.08,35.57 27.08,36.87 v27.69,37.48 27.27,37.91 | 48.28,20.76 48.28,18.14 47.6,17.46 46.67,17.46 v46.61,17.51
  Top 0.203: 26.75,36.26 26.75,37.4 27.27,37.91 | 27.69,38.34 27.92,38.56 30.24,38.56 30.59,38.21 30.59,34.68 33.33,31.94 v36.51,31.94 | 48.28,20.76 48.01,21.03 U1.2
  Top 0.254: 27.69,38.34 26.86,37.51 J2.1
  Top 0.305: J2.1 26.86,36.65 v27.69,37.48
  Bottom 0.203: v36.51,31.94 36.61,32.04 37.56,32.04 38.28,31.32 43.34,31.32 47.1,27.56 47.1,24.62 44.54,22.06 44.54,19.25 46.28,17.51 v46.61,17.51
  Bottom 0.305: v27.69,37.48 26.99,36.78 P8.P$1
GP1/UART0_RX  (via drill 0.3, 0.35)
  Top 0.2: R83.2 21.45,31.52 22.24,32.31 24.71,32.31 26.32,33.93 28.08,33.93 29.35,35.2 J2.2 29.35,35.12 29.72,34.75
  Top 0.203: U1.3 48.41,21.31 48.74,20.98 48.74,17.99 47.63,16.87 v46,16.87 v45.99,16.86 | v37.28,31.24 37.18,31.14 33.33,31.14 29.72,34.75 29.23,35.24
  Top 0.305: J2.2 28.93,36.77 v28.46,36.77
  Bottom 0.203: v45.99,16.86 45.99,17.09 44.07,19.01 44.07,22.3 46.63,24.86 46.63,27.31 43.27,30.67 38.04,30.67 37.47,31.24 v37.28,31.24
  Bottom 0.305: P17.P$1 v28.48,36.78 v28.46,36.77
GP2/I2C1_SDA  (via drill 0.35)
  Top 0.2: J2.3 31.89,34.21 33.56,32.54
  Top 0.203: v47.85,24.72 v47.86,24.71 47.86,24.47 48.81,23.52 U1.4 | v35.71,32.74 35.51,32.54 33.56,32.54
  Bottom 0.203: v47.85,24.72 47.8,24.77 47.8,27.53 43.56,31.77 38.65,31.77 37.7,32.72 35.9,32.72 35.71,32.72 v35.71,32.74
  Bottom 0.305: P18.P$1 35.67,32.72 35.9,32.72
GP3/I2C1_SCL  (via drill 0.35)
  Top 0.2: J2.4 34.43,34.99 34.98,34.44
  Top 0.203: U1.5 49.21,18.79 v49.5,18.5 | 34.98,34.12 34.98,34.44 34.98,34.58 34.65,34.91 34.65,35.73
  Top 0.254: 34.98,33.94 34.98,34.58 | J2.4 34.94,35.84 v34.94,34.07
  Top 0.305: v34.94,34.07 34.94,33.98 34.98,33.94 34.98,34.12
  Bottom 0.203: v49.5,18.5 49.5,18.79 48.6,19.69 48.6,27.41 43.69,32.32 39,32.32 37.8,33.52 35.49,33.52 v34.94,34.07
  Bottom 0.305: v34.94,34.07 34.94,35.24 P19.P$1
GP4/UART1_TX  (via drill 0.3, 0.35)
  Top 0.2: J1.2 v19.78,11.41 | v49.06,16.44 48.54,16.44 46.86,14.76 v46.86,12.9 | v36.99,38.39 36.99,35.18
  Top 0.203: v49.99,19.44 49.61,19.82 U1.6 | v39.44,33.1 39.07,33.1 36.99,35.18 | J2.5 36.97,38.36 v36.99,38.39
  Bottom 0.2: v49.99,19.44 50.12,19.32 50.12,17.13 49.45,16.46 49.08,16.46 v49.06,16.44 | v46.86,12.9 46.86,12.87 46.14,12.15 20.43,12.15 19.78,11.5 v19.78,11.41
  Bottom 0.203: v49.99,19.44 49.09,20.34 49.09,27.61 43.64,33.06 39.48,33.06 v39.44,33.1
  Bottom 0.254: P23.P$1 19.8,11.39 v19.78,11.41
  Bottom 0.305: P20.P$1 37.01,38.37 v36.99,38.39
GP5/UART1_RX  (via drill 0.35)
  Top 0.2: J1.1 v21.79,11.39 | v47.13,11.94 47.78,12.59 47.78,15 48.47,15.69 49.4,15.69 50.4,16.7 50.74,16.7 v50.76,16.71
  Top 0.203: U1.7 50.01,21.58 v50.32,21.27
  Top 0.254: v40.68,37.53 39.74,37.53 39.73,37.54 39.51,37.32 J2.6
  Bottom 0.2: v21.79,11.39 22.02,11.62 46.81,11.62 v47.13,11.94 | v50.32,21.27 50.76,20.83 v50.76,16.71 | 43.11,35.05 41.08,35.05
  Bottom 0.203: v50.32,21.27 49.56,22.03 49.56,29.73 44.24,35.05 43.11,35.05
  Bottom 0.254: P24.P$1 v21.8,11.38 v21.79,11.39 | 41.08,35.05 40.68,35.45 v40.68,37.53 40.64,37.57 P50.P$1
GP6*I2C1_SDA  (via drill 0.3, 0.35)
  Top 0.2: 42.05,35.99 42.05,33.67 42.09,33.63
  Top 0.203: 42.09,33.63 42.29,33.43 47.99,33.43 v48.1,33.32 | v50.3,23.58 50.41,23.47 U1.8 | 42.92,35.9 v42.92,36.05 | v42.92,36.05 42.11,36.05 42.05,35.99 | v42.92,36.05 42.35,36.05 J2.7
  Bottom 0.203: v48.1,33.32 48.1,33.29 50.64,30.75 50.64,23.98 50.31,23.64 v50.31,23.59 v50.3,23.58
  Bottom 0.305: P51.P$1 42.13,36.05 v42.92,36.05
GP7*I2C1_SCL  (via drill 0.3, 0.35)
  Top 0.2: J2.8 44.59,35.24 45.77,34.06
  Top 0.203: v48.87,33.76 48.79,33.76 48.49,34.06 45.77,34.06 | U1.9 50.81,23.04 51.31,23.54 v51.31,23.57 | J2.8 44.8,36.14 44.8,34.73
  Top 0.254: J2.8 44.59,37.44 44.73,37.58 v45.52,37.58
  Bottom 0.203: v48.87,33.76 48.87,33.29 51.31,30.85 v51.31,23.57
  Bottom 0.305: v45.52,37.58 45.5,37.56 P52.P$1
GP8/LCD_DC  (via drill 0.35)
  Top 0.2: U1.11 51.61,21.54 51.93,21.22 v52.06,21.22 | v35.1,15.52 34,15.52 v31.3,18.22
  Bottom 0.2: v52.06,21.22 52.47,20.81 52.47,16.47 51.18,15.18 35.44,15.18 v35.1,15.52 | P34.P$1 19.64,18.37 20.84,19.57 J17.P$4 28.61,19.57 29.74,18.44 31.09,18.44 v31.3,18.22
GP9/LCD_CS/SPI_CS0  (via drill 0.35)
  Top 0.2: U1.12 52.01,23.2 v52.36,23.54 | v33.7,19.82 35.8,19.82 37.95,17.67 v37.95,17.63
  Bottom 0.2: 32.7,19.67 33.7,19.67 v33.7,19.82 | 32.7,19.67 32.21,19.67 31.51,20.37 J17.P$5 | 39.76,15.71 50.89,15.71 51.97,16.8 51.97,20.2 51.3,20.87 51.3,22.49 v52.36,23.54 | 32.74,20.62 P35.P$1 32.74,19.71 32.7,19.67
  Bottom 0.203: 39.76,15.71 39.76,15.82 v37.95,17.63
GP10/SPI_CLK/LCD_CLK/TP_CLK/SD_CLK  (via drill 0.3, 0.35)
  Top 0.2: U1.13 52.41,21.87 52.88,21.4 v53.42,21.4 | v54.6,17.02 54.84,16.78 SD1.5 | v29.4,17.92 30.5,17.92 33.7,14.72 34.3,14.72 v34.4,14.62 | U3.16 35.25,30.36 34.74,29.85 v34.67,29.85 | v41.57,14.11 41.6,14.14 R103.1
  Bottom 0.2: v53.42,21.4 54.6,20.22 v54.6,17.02 52.2,14.62 51,14.62 | 51,14.62 41.57,14.62 | 41.57,14.62 v34.4,14.62 | v34.67,29.85 34.67,29.79 36,28.46 36,22.03 | 36,22.03 36,21.03 32.46,17.49 30.93,17.49 30.5,17.92 v29.4,17.92 29.4,17.96 28.59,18.77 J17.P$3 | P32.P$1 35.96,22.07 36,22.03 | P45.P$1 51,14.62 | v41.57,14.11 41.57,14.62
GP11/SPI_MOSI/LCD_SDI/TP_SDI/SD_SDI  (via drill 0.35)
  Top 0.2: U1.14 58.82,22.41 59.5,21.72 v60.7,21.72 | R112.2 61.84,18.72 v60.7,18.72 | U3.14 35.8,29.09 35.17,28.46 v35.17,28.21 | v37.75,40.15 38.03,40.43 38.03,43.1 v38.47,43.54 | SD1.3 57.04,15.82
  Top 0.254: 57.04,15.82 57.04,16.19 58.85,18 60.02,18 60.68,18.66 R112.2 | R104.1 v30.8,21.12
  Bottom 0.2: 60.7,19.42 v60.7,21.72 v60.71,21.74 60.71,22.7 59.99,23.42 59.99,41.04 56.74,44.29 39.93,44.29 39.17,43.54 v38.47,43.54 38.47,43.66 38.48,43.67 | 60.7,19.42 v60.7,18.72 | P44.P$1 19.67,21.17 J17.P$6 30.75,21.17 v30.8,21.12 30.8,21.17 32.18,21.17 35.42,24.41 35.42,27.85 35.17,28.1 v35.17,28.21 33.57,29.81 33.57,37.59 36.1,40.12 37.72,40.12 v37.75,40.15 | P36.P$1 60.8,19.52 60.7,19.42
  Bottom 0.254: 61.48,19.54 P36.P$1
GP12/SPI_MISO/LCD_SDO/TP_SDO/SD_SDO  (via drill 0.35)
  Top 0.2: U1.15 56.6,23.24 v56.6,23.22 | v55.7,13.22 55.5,13.02 53.24,13.02 52.64,13.62 SD1.7 | U3.12 35.79,27.82 35.47,27.5 32.64,27.5 v32.38,27.76
  Top 0.254: SD1.7 52.64,16.37 52.3,16.71 R113.2
  Bottom 0.2: 55.7,13.92 55.7,15.22 56.4,15.92 56.4,23.02 v56.6,23.22 58.4,23.22 59.42,24.24 59.42,40.85 57.46,42.81 | 55.7,13.92 v55.7,13.22 | 36.69,42.81 32.14,38.26 32.14,28 v32.38,27.76 | P46.P$1 55.7,13.92
  Bottom 0.203: 57.46,42.81 56.45,43.82 40.2,43.82 39.2,42.82 36.7,42.82 36.69,42.81
GP14/BUZZER  (via drill 0.35)
  Top 0.2: U1.17 58.27,24.04 v59.64,22.67 | Q2.1 67.88,6.3 v67.29,6.3
  Top 0.508: R14.2 68.14,4.83 Q2.1
  Bottom 0.2: v67.29,6.3 67.29,8.02 59.86,15.45 59.86,22.45 v59.64,22.67
GP15/LCD_RST  (via drill 0.3)
  Top 0.2: U1.18 60.43,24.44 v60.8,24.07
  Bottom 0.2: J17.P$2 22.33,17.97 19.88,15.52 P31.P$1 19.88,15.6 18.6,16.88 18.6,29.92 33.5,44.82 56.99,44.82 60.5,41.31 60.5,25.05 60.8,24.75 v60.8,24.07
GP16/TP_CS/SPI_CS1  (via drill 0.3, 0.35)
  Top 0.2: U1.27 54.52,28.04 54.92,28.44 54.92,29.08 56.88,31.04 58.58,31.04 v58.67,30.95 | U3.15 35.61,29.73 34.55,28.67 v32.91,28.67
  Bottom 0.2: v58.67,30.95 58.67,31.37 58.89,31.59 58.89,40.6 57.31,42.18 | v32.91,28.67 32.62,28.95 32.62,38.07 36.73,42.18
  Bottom 0.203: 57.31,42.18 56.16,43.32 40.5,43.32 39.5,42.32 36.88,42.32 36.73,42.18
GP17/TP_IRQ  (via drill 0.3)
  Top 0.2: U1.28 54.25,28.44 54.45,28.65 54.45,29.32
  Top 0.203: v57.97,31.69 56.83,31.69 54.45,29.32 | R105.1 v38.4,27.72 38.4,27.49 38.13,27.22 36.84,27.22 U3.11 | v38.8,41.48 38.78,41.46 v38.78,40.15
  Bottom 0.2: 34.53,31.09 34.06,31.57 34.06,31.59
  Bottom 0.203: v38.4,27.72 37.9,27.72 34.53,31.09 | 34.06,31.59 34.06,37.36 36.23,39.53 38.14,39.53 38.76,40.15 v38.78,40.15 | v57.97,31.69 58.37,32.09 58.37,40.3 55.85,42.82 40.8,42.82 39.4,41.42 38.88,41.42 38.81,41.49 v38.8,41.48
GP18/LCD_BL_PWM  (via drill 0.3, 0.35)
  Top 0.2: U1.29 53.76,29.28 56.85,32.37 v57.27,32.37 | v27.57,24.97 27.55,25
  Top 0.203: Q1.1 25.48,25 | 25.48,25 25.48,25.84 R8.2 | 27.55,25 25.48,25
  Bottom 0.2: v57.27,32.37 57.82,32.92 57.82,40.16 | v27.57,24.97 28.08,24.46 32.59,24.46 33.73,25.6 33.73,28.91 33.09,29.55 33.09,37.84 36.07,40.82
  Bottom 0.203: 57.82,40.16 55.66,42.32 41,42.32 39.5,40.82 36.07,40.82
GP19*  (via drill 0.3, 0.35)
  Top 0.2: U1.30 52.41,29.82 52.42,29.83 | J2.9 47.13,37.43 47.28,37.57 v47.99,37.57 47.48,37.57 47.48,39.16
  Top 0.203: 47.48,39.16 49.27,40.94 54.88,40.94 v54.9,40.96 | 52.42,29.83 52.78,30.19 53.87,30.19 54.7,31.03 v54.7,31.72
  Bottom 0.203: v54.9,40.96 54.9,40.06 54.5,39.66 54.5,31.92 v54.7,31.72
  Bottom 0.305: v47.99,37.57 v47.98,37.56 P53.P$1
GP20/I2C0_SDA  (via drill 0.3, 0.35)
  Top 0.2: 71.53,17.55 62.6,8.62 | v49.71,38.41 49.71,39.29 50.6,40.17
  Top 0.203: 50.6,40.17 v53.99,40.17 v54,40.18 54.04,40.22 63.4,40.22 v63.42,40.24 | U1.31 52.01,30.03 52.62,30.65 53.42,30.65 53.96,31.19 v53.96,31.27 | v38.28,7.58 39.04,6.82 40.8,6.82 42.6,8.62 62.6,8.62 | 71.53,17.55 71.53,38.57 70.2,39.9 v70.2,40.02
  Top 0.254: R3.1 38.28,15.04 J6.2 38.3,9.45 38.3,8.84 38.28,8.82 v38.28,7.58
  Top 0.305: J2.10 49.67,38.37 v49.71,38.41
  Bottom 0.203: v54,40.18 53.96,40.18 53.96,32.63 v53.96,31.27 | v63.42,40.24 63.63,40.02 v70.2,40.02
  Bottom 0.254: P15.P$1 38.3,7.56 v38.28,7.58
  Bottom 0.305: P54.P$1 v49.71,38.41
GP21/I2C0_SCL  (via drill 0.3, 0.35)
  Top 0.2: v53.11,32.42 52.01,32.42 51.61,32.02 | 69.4,16.12 66.6,13.32
  Top 0.203: 51.61,32.02 U1.32 | J6.1 40.63,9.12 62.4,9.12 66.6,13.32 | 69.4,16.12 71.06,17.78 71.06,38.06 v70.3,38.82 | v63.56,38.52 63.04,39.04 52.58,39.04 v52.12,38.58 | 52.19,35.5 52.19,36.34 J2.11 52.21,35.52 52.19,35.5
  Top 0.254: R26.1 40.28,15.04 J6.1 40.3,9.45 v40.3,7.61 | J2.11 52.12,36.44 v52.12,38.58
  Bottom 0.203: 53.08,32.45 v53.11,32.42 53.11,37.47 52.15,38.43 | v70.3,38.82 69.99,38.52 v63.56,38.52
  Bottom 0.254: P16.P$1 v40.3,7.61
  Bottom 0.305: P55.P$1 52.15,38.43 52.15,38.55 v52.12,38.58
GP22/SD_CS/SPI_CS2  (via drill 0.35)
  Top 0.2: U1.34 50.81,28.56 51.08,28.29 52.55,28.29 v52.6,28.24 | v58.18,12.45 58.14,12.49 SD1.2
  Top 0.254: SD1.2 58.14,16.43 59.03,17.32 62,17.32 63.2,18.52 R109.2
  Bottom 0.2: v52.6,28.24 52.6,28.13 55.8,24.93 55.8,16.22 54.7,15.12 54.7,12.92 55.2,12.42 58.15,12.42 v58.18,12.45
  Bottom 0.254: v58.18,12.45 58.2,12.43 P47.P$1
GP26*ADC0*I2C1_SDA  (via drill 0.35)
  Top 0.2: U1.38 49.21,31.53 50.85,33.17 55.92,33.17 v56.46,33.71 | 54.8,35.3 v55.58,35.3 55.46,35.3
  Top 0.254: J2.12 55.58,35.52 v55.58,35.3
  Bottom 0.2: v56.46,33.71 55.58,34.59 v55.58,35.3
  Bottom 0.305: v55.58,35.3 55.49,35.39 P56.P$1
GP27*ADC1*I2C1_SCL  (via drill 0.3)
  Top 0.2: U1.39 48.81,31.77 50.66,33.62 55.44,33.62 56.52,34.7 57.13,34.7 57.25,34.82 | 57.4,34.82 57.25,34.82 | 57.46,36.18 57.46,34.88 | J2.13 57.29,34.86 57.25,34.82
  Top 0.203: 57.4,36.24 57.4,34.82 | J2.13 57.46,36.18
  Top 0.254: 57.4,36.24 J2.13 57.29,37.39 57.18,37.5 v56.36,37.5
  Bottom 0.305: v56.36,37.5 56.94,38.09 56.94,38.85 P57.P$1
GP28*ADC2  (via drill 0.3)
  Top 0.2: 48.41,32.1 | U1.40 48.41,32.1 | 59.59,37.78 58.8,38.56 53.93,38.56 53.65,38.28 53.65,34.52 53.25,34.12 50.43,34.12 48.41,32.1 | 59.83,37.53 59.88,37.48 | 59.83,37.53 J2.14 59.59,36.6 59.59,37.78 | 59.83,37.53 59.59,37.78
  Top 0.203: 59.88,36.5 59.88,37.48
  Top 0.305: v61.16,37.49 v61.16,37.48 59.88,37.48
  Bottom 0.305: P58.P$1 61.55,38.67 61.51,38.63 61.51,37.83 v61.16,37.49
GP29/BAT+_ADC3
  Top 0.2: R19.1 40.66,30.22 R20.2 40.66,30.59 | U1.41 48.01,31.97 48.01,31.98
  Top 0.203: 48.01,31.98 47.06,32.92 42.2,32.92 40.66,31.39 40.66,30.22
LED-A  (via drill 0.35)
  Top 0.406: v27.07,24.38 26.78,24.09 26.78,22.89 R10.1
  Bottom 0.406: J17.P$10 27.05,24.37 v27.07,24.38
  Bottom 0.508: J17.P$10 19.73,24.37 P5.P$1
LED-K  (via drill 0.3)
  Top 0.508: R9.2 23.79,21.47 21.58,23.68 v21.58,25.19
  Bottom 0.508: v21.58,25.19 21.58,25.46 | v21.58,25.19 21.58,25.96 | J17.P$14 21.87,27.57 21.58,27.28 21.58,26.77 | P41.P$1 19.77,26.99 20.79,25.97 J17.P$12 21.61,25.97 21.58,25.96 | J17.P$13 21.58,26.77 | J17.P$11 21.58,25.17 v21.58,25.19 | 21.58,25.96 21.58,26.77
N$1
  Top 0.2: C2.2 R2.1 64.69,27.26 63.23,25.8 X1.3
N$2
  Top 0.2: U1.21 61.24,25.64 62.86,27.26 R2.2
N$3
  Top 0.2: U1.20 61.78,25.24 62.5,24.52 63.88,24.52 X1.1 64.84,23.39 C1.1
N$4  (via drill 0.35)
  Top 0.508: D1.- v69.43,9.6 v69.43,9.61 69.43,10.25 69.25,10.43 R4.1 | B1.1 75.04,10.51 v73.71,10.51
  Bottom 0.508: v73.71,10.51 72.8,9.61 v69.43,9.61
N$5
  Top 0.254: J15.B5 13.85,35.14 R68.1
N$6
  Top 0.508: B1.2 71.1,8.86 70.17,7.94 Q2.3 68.69,7.94 67.83,8.79 D1.+
N$7
  Top 0.508: R9.1 25.4,21.39 25.4,22.12 24.97,22.55 Q1.3
N$9  (via drill 0.35)
  Top 0.254: 13.22,22.84 R84.1 v12.91,23.68 | U5.5 16.09,27.29 v16.09,23.61
  Bottom 0.254: v16.09,23.61 16.01,23.68 v12.91,23.68
N$10
  Top 0.61: U6.3 22.24,18.55 23.18,18.55 23.68,18.55 L2.1
N$12
  Top 0.254: R12.1 11.69,13.26 10.53,12.1 J14.B5
N$14
  Top 0.254: R13.2 11.71,14.78 11.39,15.1 J14.A5
N$15
  Top 0.254: R85.1 D15.+
N$16
  Top 0.254: J15.A5 16.85,35.34 R69.2
N$20
  Top 0.2: R106.2 29.86,23.72 29.86,26.19 30.23,26.55 U3.7
  Top 0.203: R106.2 29.87,23.72 | 30.93,26.53 U3.7
N$22
  Top 0.254: SD1.1 59.24,16.45 59.62,16.83 62.82,16.83 64.57,18.59 R110.2
N$24
  Top 0.254: SD1.8 51.54,18.04 51,18.58 R111.2
N$28
  Top 0.254: U7.9 19.64,32.92 R70.1
N$31
  Top 0.254: R83.1 19.64,31.52 18.74,32.42 U7.8
N$35
  Top 0.254: R35.1 3.39,23.94 D3.+
N$43
  Top 0.254: R82.2 23.79,14.61 21.06,14.61 19.02,16.65 U6.5
  Top 0.508: R81.2 R82.2
QSPI_CS  (via drill 0.35)
  Top 0.2: U2.1 34.73,23.16 39.23,18.65 41.42,18.65 v41.79,19.02 | U1.56 46.53,23.24 46.53,19.54 43.91,16.92 43.24,16.92 | R6.1 43.07,16.76 43.24,16.92 | 43.24,16.92 43.27,16.96 43.88,16.96 v43.9,16.97
  Top 0.254: U2.1 31.75,23.16 30.96,22.37 R7.1
  Bottom 0.2: v41.79,19.02 41.79,18.87
  Bottom 0.305: v43.9,16.97 41.84,19.02 v41.79,19.02
QSPI_D0
  Top 0.2: U1.53 45.95,24.45 45.6,24.11 45.6,21.5 43.84,19.74 41.25,19.74 40.96,19.45 40.45,19.45 U2.5
QSPI_D1  (via drill 0.35)
  Top 0.2: U2.2 35.27,21.89 38.95,18.2 43.73,18.2 45.24,19.71 v45.24,20.09 | U1.55 46.78,23.63 47.65,23.63 v47.84,23.44
  Bottom 0.2: v47.84,23.44 46.66,23.44 45.24,22.02 v45.24,20.09
QSPI_D2
  Top 0.2: U1.54 46.13,24.04 46.02,23.93 46.02,19.74 44.01,17.73 38.65,17.73 35.77,20.62 U2.3
QSPI_D3
  Top 0.2: U1.51 45.41,25.24 44.77,24.6 44.77,21.93 43.6,20.77 41.86,20.77 40.74,21.89 U2.7
QSPI_SCK
  Top 0.2: U1.52 45.68,24.84 45.19,24.36 45.19,21.72 43.71,20.24 41.3,20.24 40.92,20.62 U2.6
RESET
  Top 0.2: 64.68,31.18 63.46,29.97 63.42,30.01 C4.1 63.27,29.9 62.82,30.35 56.89,30.35 55.44,28.91 55.44,28.26 54.82,27.64 U1.26 | 64.68,31.18 R1.1 | 64.6,31.18 64.68,31.18 | SW1.2 69.13,33.89
  Top 0.254: R1.1 66.5,32.84 67.72,34.06 SW1.2
SWCLK  (via drill 0.3)
  Top 0.203: U1.24 55.94,26.84 v56.21,27.11
  Bottom 0.203: v56.21,27.11 56.21,26.24 P11.P$1
SWDIO  (via drill 0.3)
  Top 0.203: U1.25 55.12,27.24 56.14,28.26 v56.14,28.43
  Bottom 0.203: P12.P$1 56.14,29.24 v56.14,28.43
TP_X+  (via drill 0.35)
  Top 0.203: U3.2 28.46,29.73 C30.2 27.59,30.59 v27.59,32.44
  Bottom 0.2: J17.P$15 21.46,28.37 21.45,28.37 20.57,29.25 20.57,30.99 22.02,32.44 26.12,32.44 | P33.P$1 26.09,32.47 26.12,32.44 | 26.12,32.44 v27.59,32.44
TP_X-  (via drill 0.35)
  Top 0.203: U3.4 29.93,28.46 29.45,27.97 v29.4,28.02 29.3,28.02 28.5,27.22 C39.2
  Bottom 0.2: J17.P$17 24.96,29.92 P38.P$1
  Bottom 0.203: v29.4,28.02 27.45,29.97 J17.P$17
TP_Y+  (via drill 0.35)
  Top 0.203: U3.3 29.47,29.09 v29.4,29.02 28.86,29.02 C38.2
  Bottom 0.2: P39.P$1 29.36,29.07
  Bottom 0.203: v29.4,29.02 29.36,29.07 27.6,30.82 25.02,30.82 J17.P$18
TP_Y-  (via drill 0.35)
  Top 0.2: U3.5
  Top 0.203: U3.5 30.32,27.82 29.5,27 v29.5,26.92 29.48,26.92 28.48,25.92 C40.2
  Bottom 0.2: P37.P$1 29.57,26.81 28.86,27.51 28.54,27.83
  Bottom 0.203: J17.P$16 24.97,29.16 27.21,29.16 28.54,27.83 | v29.5,26.92 29.45,26.92 28.86,27.51
UART_USB_D+  (via drill 0.3)
  Top 0.254: J15.A6 15.85,37.32 | 15.85,37.32 15.85,36.57 15,35.72 15,34.22 14.2,33.42 U7.1 11.7,33.42 v11.4,33.72 | J15.B6 14.85,37.47 15,37.32 15.85,37.32
  Bottom 0.254: v11.4,33.72 P27.P$1
UART_USB_D-  (via drill 0.3)
  Top 0.254: J15.A7 15.35,39.77 15.5,39.92 16.2,39.92 16.35,39.77 J15.B7 16.35,36.27 15.5,35.42 15.5,33.92 14.5,32.92 U7.2 11.7,32.92 v11.4,32.62
  Bottom 0.254: v11.4,32.62 P28.P$1
USB_D+  (via drill 0.35)
  Top 0.203: U1.47 45.42,26.84 45.31,26.74 v45.12,26.74 | J14.A6 9.38,14.1 9.52,13.97 9.52,13.42 10.07,13.42 v10.09,13.44 9.56,13.44 9.52,13.39 9.52,13.23 9.37,13.07 8.13,13.07 J14.B6
  Bottom 0.203: 14.36,15.09 18.19,15.09 20.51,12.77 29.54,12.77 43.71,26.94 44.56,26.94 44.76,26.74 v45.12,26.74 | 14.36,15.09 14.36,13.77 P3.P$1 | v10.09,13.44 10.23,13.44 11.89,15.09 14.36,15.09
USB_D-  (via drill 0.35)
  Top 0.203: U1.46 45.6,27.24 45.17,27.67 v45.13,27.67 | J14.A7 7.04,13.6 6.85,13.79 6.85,14.42 7.04,14.6 J14.B7 9.58,14.6 9.95,14.23 v10.1,14.23
  Bottom 0.203: 14.33,15.53 18.44,15.53 20.75,13.22 29.3,13.22 43.46,27.38 44.53,27.38 44.82,27.67 v45.13,27.67 | 14.33,15.53 14.3,15.57 P4.P$1 | 14.33,15.53 11.56,15.53 10.23,14.2 10.13,14.2 v10.1,14.23
VBAT_IN  (via drill 0.35, 0.4)
  Top 0.508: U5.4 13.3,26.62 C23.1 13,26.32 C22.2 | C22.2 12.91,24.85 | D4.2 13.65,19.66 v13.65,20.44 D5.2 13.78,21.21 14.12,21.55 14.12,23.82 C22.2 | Q19.1 6.84,23.09 R66.2 6.84,20.55 v6.79,20.51
  Bottom 0.508: v6.79,20.51 6.86,20.44 v13.65,20.44 13.68,20.44
VIN  (via drill 0.35)
  Top 0.254: D8.2 13.71,18.14
  Top 0.508: 17.09,18.42 C31.2 15.1,18.14 13.71,18.14 | 17.09,18.42 C32.1 v17.21,20.54 v17.2,20.55 | 17.09,18.42 17.22,18.55 U6.4 18.89,18.57 19.34,18.57 19.93,17.97 19.93,17.13 20.41,16.65 U6.1 | D2.- 9.9,23.34 | 9.9,23.34 9.9,22.77 v9.95,22.72 | Q19.2 9.88,23.32 9.9,23.34 | D6.2 D8.2 13.71,18.14
  Bottom 0.508: v17.2,20.55 17.2,22.17 16.65,22.72 v9.95,22.72
(copper drawn outside any net)
  shapes: Top area x2

## Text on the board
tPlace: J2 | TX0_GP0 | RX0_GP1 | + | GND | 3.3V | GP | 0 | 1 | 2 | 3 | 4 | 5 | 6 | 7 | 19 | 20 | 21 | 26 | 27 | 28 | - | V1.0 | Pico Display-2.4 Inch | SKU:DIS09024P | GND | 3.3V | GND | 3.3V | TX1_GP4 | RX1_GP5 | SDA_GP20 | SCL_GP21
bPlace: GND | 5V | 3.3V | GND | BAT+ | D+ | D- | GND | GND | GND | 3.3V | 3.3V | 5V_USB | GND | GND | 3.3V | GND | 3.3V
tNames: D5 | D4 | D8 | D6